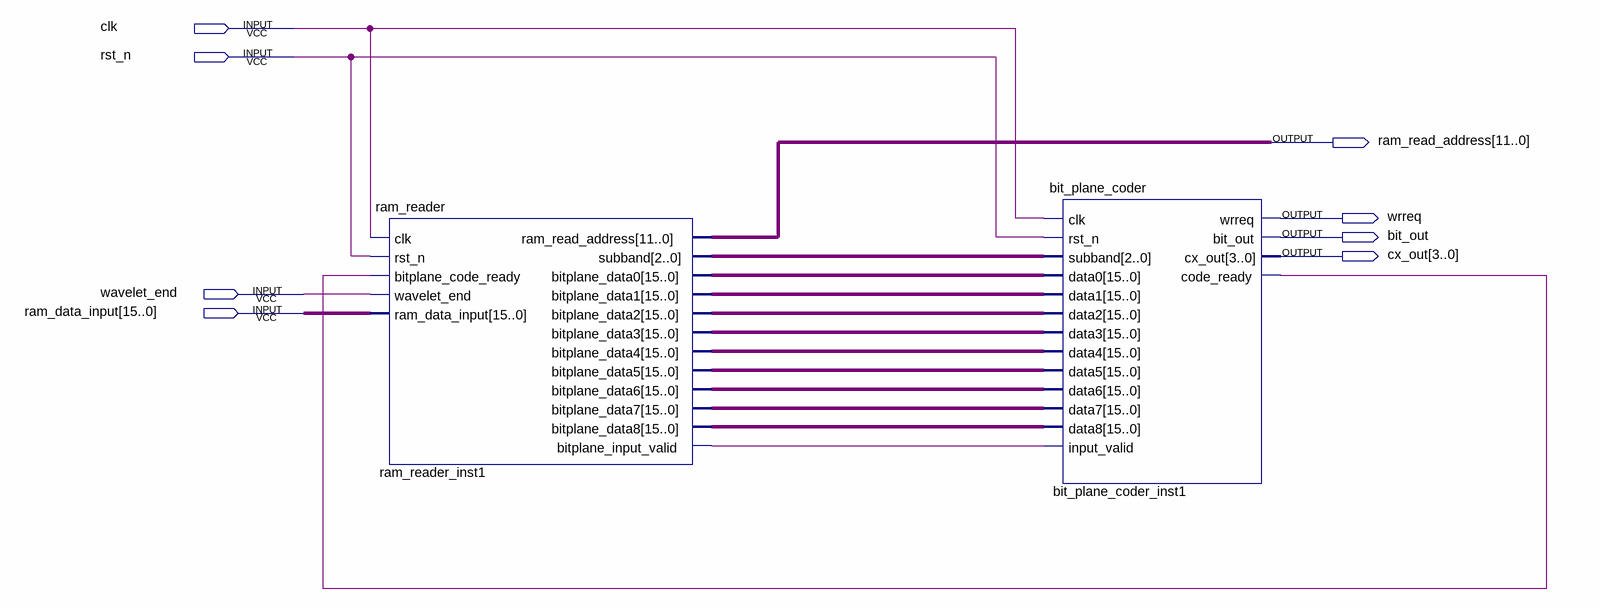
[diagram p0: schematic sheet]
// Quartus schematic ram_conversion.bdf as structural Verilog: 2 symbols, 8 pins
module ram_conversion (
  input  clk,
  input  rst_n,
  input  wavelet_end,
  input  [15:0] ram_data_input,
  output [11:0] ram_read_address,
  output wrreq,
  output bit_out,
  output [3:0] cx_out
);

  wire bit_plane_coder_inst1_code_ready, ram_reader_inst1_bitplane_input_valid;
  wire [2:0] ram_reader_inst1_subband;
  wire [15:0] ram_reader_inst1_bitplane_data0, ram_reader_inst1_bitplane_data1,
       ram_reader_inst1_bitplane_data2, ram_reader_inst1_bitplane_data3, ram_reader_inst1_bitplane_data4,
       ram_reader_inst1_bitplane_data5, ram_reader_inst1_bitplane_data6, ram_reader_inst1_bitplane_data7,
       ram_reader_inst1_bitplane_data8;

  ram_reader ram_reader_inst1 (
    .clk(clk), .rst_n(rst_n), .bitplane_code_ready(bit_plane_coder_inst1_code_ready),
    .wavelet_end(wavelet_end), .ram_data_input(ram_data_input), .ram_read_address(ram_read_address),
    .subband(ram_reader_inst1_subband), .bitplane_data0(ram_reader_inst1_bitplane_data0),
    .bitplane_data1(ram_reader_inst1_bitplane_data1), .bitplane_data2(ram_reader_inst1_bitplane_data2),
    .bitplane_data3(ram_reader_inst1_bitplane_data3), .bitplane_data4(ram_reader_inst1_bitplane_data4),
    .bitplane_data5(ram_reader_inst1_bitplane_data5), .bitplane_data6(ram_reader_inst1_bitplane_data6),
    .bitplane_data7(ram_reader_inst1_bitplane_data7), .bitplane_data8(ram_reader_inst1_bitplane_data8),
    .bitplane_input_valid(ram_reader_inst1_bitplane_input_valid));
  bit_plane_coder bit_plane_coder_inst1 (
    .clk(clk), .rst_n(rst_n), .subband(ram_reader_inst1_subband), .data0(ram_reader_inst1_bitplane_data0),
    .data1(ram_reader_inst1_bitplane_data1), .data2(ram_reader_inst1_bitplane_data2),
    .data3(ram_reader_inst1_bitplane_data3), .data4(ram_reader_inst1_bitplane_data4),
    .data5(ram_reader_inst1_bitplane_data5), .data6(ram_reader_inst1_bitplane_data6),
    .data7(ram_reader_inst1_bitplane_data7), .data8(ram_reader_inst1_bitplane_data8),
    .input_valid(ram_reader_inst1_bitplane_input_valid), .wrreq(wrreq), .bit_out(bit_out), .cx_out(cx_out),
    .code_ready(bit_plane_coder_inst1_code_ready));
endmodule
